# EAGLE design SpheroRemote (EAGLE 9.0.1)
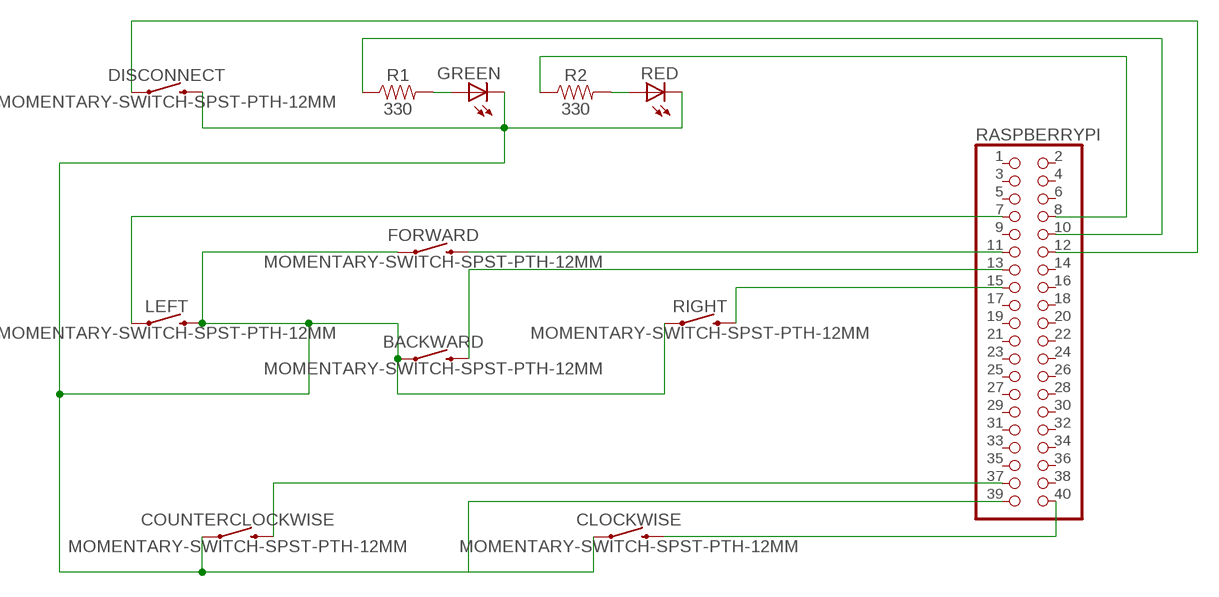
[diagram p0: schematic, sheet 1]

## Parts
BACKWARD  MOMENTARY-SWITCH-SPST-PTH-12MM  [TACTILE_SWITCH_PTH_12MM]
CLOCKWISE  MOMENTARY-SWITCH-SPST-PTH-12MM  [TACTILE_SWITCH_PTH_12MM]
COUNTERCLOCKWISE  MOMENTARY-SWITCH-SPST-PTH-12MM  [TACTILE_SWITCH_PTH_12MM]
DISCONNECT  MOMENTARY-SWITCH-SPST-PTH-12MM  [TACTILE_SWITCH_PTH_12MM]
FORWARD  MOMENTARY-SWITCH-SPST-PTH-12MM  [TACTILE_SWITCH_PTH_12MM]
GREEN  LED5MM  [LED5MM]
LEFT  MOMENTARY-SWITCH-SPST-PTH-12MM  [TACTILE_SWITCH_PTH_12MM]
R1  330  330OHM-HORIZ-1/10W-5%  [AXIAL-0.3]
R2  330  330OHM-HORIZ-1/10W-5%  [AXIAL-0.3]
RASPBERRYPI  PINHD-2X20  [2X20]
RED  LED5MM  [LED5MM]
RIGHT  MOMENTARY-SWITCH-SPST-PTH-12MM  [TACTILE_SWITCH_PTH_12MM]

## Nets
N$1: R2.P$2 RED.A
N$2: CLOCKWISE.3 RASPBERRYPI.40
N$3: COUNTERCLOCKWISE.3 RASPBERRYPI.37
N$4: R2.P$1 RASPBERRYPI.8
N$5: R1.P$1 RASPBERRYPI.10
N$6: GREEN.A R1.P$2
N$7: BACKWARD.1 CLOCKWISE.1 COUNTERCLOCKWISE.1 DISCONNECT.3 FORWARD.1 GREEN.K(C) LEFT.3 RASPBERRYPI.39 RED.K(C) RIGHT.1
N$8: LEFT.1 RASPBERRYPI.7
N$9: FORWARD.3 RASPBERRYPI.11
N$10: BACKWARD.3 RASPBERRYPI.13
N$11: RASPBERRYPI.15 RIGHT.3
N$12: DISCONNECT.1 RASPBERRYPI.12
Unconnected: RASPBERRYPI.1 RASPBERRYPI.2 RASPBERRYPI.3 RASPBERRYPI.4 RASPBERRYPI.5 RASPBERRYPI.6 RASPBERRYPI.9 RASPBERRYPI.14 RASPBERRYPI.16 RASPBERRYPI.17 RASPBERRYPI.18 RASPBERRYPI.19 RASPBERRYPI.20 RASPBERRYPI.21 RASPBERRYPI.22 RASPBERRYPI.23 RASPBERRYPI.24 RASPBERRYPI.25 RASPBERRYPI.26 RASPBERRYPI.27 RASPBERRYPI.28 RASPBERRYPI.29 RASPBERRYPI.30 RASPBERRYPI.31 RASPBERRYPI.32 RASPBERRYPI.33 RASPBERRYPI.34 RASPBERRYPI.35 RASPBERRYPI.36 RASPBERRYPI.38

## Library data of the parts
BACKWARD CLOCKWISE COUNTERCLOCKWISE DISCONNECT FORWARD LEFT RIGHT = SparkFun-Switches:MOMENTARY-SWITCH-SPST: Momentary Switch (Pushbutton) - SPST Normally-open (NO) SPST momentary switches (buttons, pushbuttons). Variants PTH-12MM - 12mm square, through-hole Momentary Pushbutton Switch - 12mm Square <https://www.sparkfun.com/products/9190> (COM-09190) PTH-6.0MM, PTH-6.0MM-KIT - 6.0mm square, through-hole Mini Pushbutton Switch <https://www.sparkfun.com/products/97> (COM-00097) KIT package intended for soldering kit's - only one side of pads' copper is exposed. PTH-RIGHT-ANGLE-KIT - Right-angle, through-hole Right Angle Tactile Button <https://www.sparkfun.com/products/10791> - Used on SparkFun BigTime Watch Kit <https://www.sparkfun.com/products/11734> SMD-12MM - 12mm square, surface-mount Tactile Button - SMD (12mm) <https://www.sparkfun.com/products/12993> (COM-12993) Used on SparkFun PicoBoard <https://www.sparkfun.com/products/11888> SMD-4.5MM - 4.5mm Square Trackball Switch Used on SparkFun Blackberry Trackballer Breakout <https://www.sparkfun.com/products/13169> SMD-4.6MMX2.8MM - 4.60mm x 2.80mm, surface mount Used on SparkFun SAMD21 Mini Breakout <https://www.sparkfun.com/products/13664> SMD-5.2MM, SMD-5.2-REDUNDANT - 5.2mm square, surface-mount Mini Pushbutton Switch - SMD <https://www.sparkfun.com/products/8720> (COM-08720) Used on Arduino Pro Mini <https://www.sparkfun.com/products/11114> REDUNDANT package connects both switch circuits together SMD-6.0X3.5MM - 6.0 x 3.5mm, surface mount Momentary Reset Switch SMD <https://www.sparkfun.com/products/8229> (COM-08229) SMD-6.2MM-TALL - 6.2mm square, surface mount Tactile Button - SMD (6mm) <https://www.sparkfun.com/products/12992> Used on SparkFun Digital Sandbox <https://www.sparkfun.com/products/12651> SMD-RIGHT-ANGLE - Right-angle, surface mount Used on SparkFun Block for Intel® Edison - Arduino <https://www.sparkfun.com/products/13036>; PROD_ID: SWCH-09185; SF_SKU: COM-09190
GREEN RED = adafruit:LED: LED OSRAM: - CHIPLED LG R971, LG N971, LY N971, LG Q971, LY Q971, LO R971, LY R971 LH N974, LH R974 LS Q976, LO Q976, LY Q976 LO Q996 - Hyper CHIPLED LW Q18S LB Q993, LB Q99A, LB R99A - SideLED LS A670, LO A670, LY A670, LG A670, LP A670 LB A673, LV A673, LT A673, LW A673 LH A674 LY A675 LS A676, LA A676, LO A676, LY A676, LW A676 LS A679, LY A679, LG A679 - Hyper Micro SIDELED® LS Y876, LA Y876, LO Y876, LY Y876 LT Y87S - SmartLED LW L88C, LW L88S LB L89C, LB L89S, LG L890 LS L89K, LO L89K, LY L89K LS L896, LA L896, LO L896, LY L896 - TOPLED LS T670, LO T670, LY T670, LG T670, LP T670 LSG T670, LSP T670, LSY T670, LOP T670, LYG T670 LG T671, LOG T671, LSG T671 LB T673, LV T673, LT T673, LW T673 LH T674 LS T676, LA T676, LO T676, LY T676, LB T676, LH T676, LSB T676, LW T676 LB T67C, LV T67C, LT T67C, LS T67K, LO T67K, LY T67K, LW E67C LS E67B, LA E67B, LO E67B, LY E67B, LB E67C, LV E67C, LT E67C LW T67C LS T679, LY T679, LG T679 LS T770, LO T770, LY T770, LG T770, LP T770 LB T773, LV T773, LT T773, LW T773 LH T774 LS E675, LA E675, LY E675, LS T675 LS T776, LA T776, LO T776, LY T776, LB T776 LHGB T686 LT T68C, LB T68C - Hyper Mini TOPLED® LB M676 - Mini TOPLED Santana® LG M470 LS M47K, LO M47K, LY M47K Source: http://www.osram.convergy.de/
R1 R2 = SparkFun-Resistors:330OHM: 330Ω resistor A resistor is a passive two-terminal electrical component that implements electrical resistance as a circuit element. Resistors act to reduce current flow, and, at the same time, act to lower voltage levels within circuits. - Wikipedia; PROD_ID: RES-8371
RASPBERRYPI = adafruit:PINHD-2X20: PIN HEADER

## Board
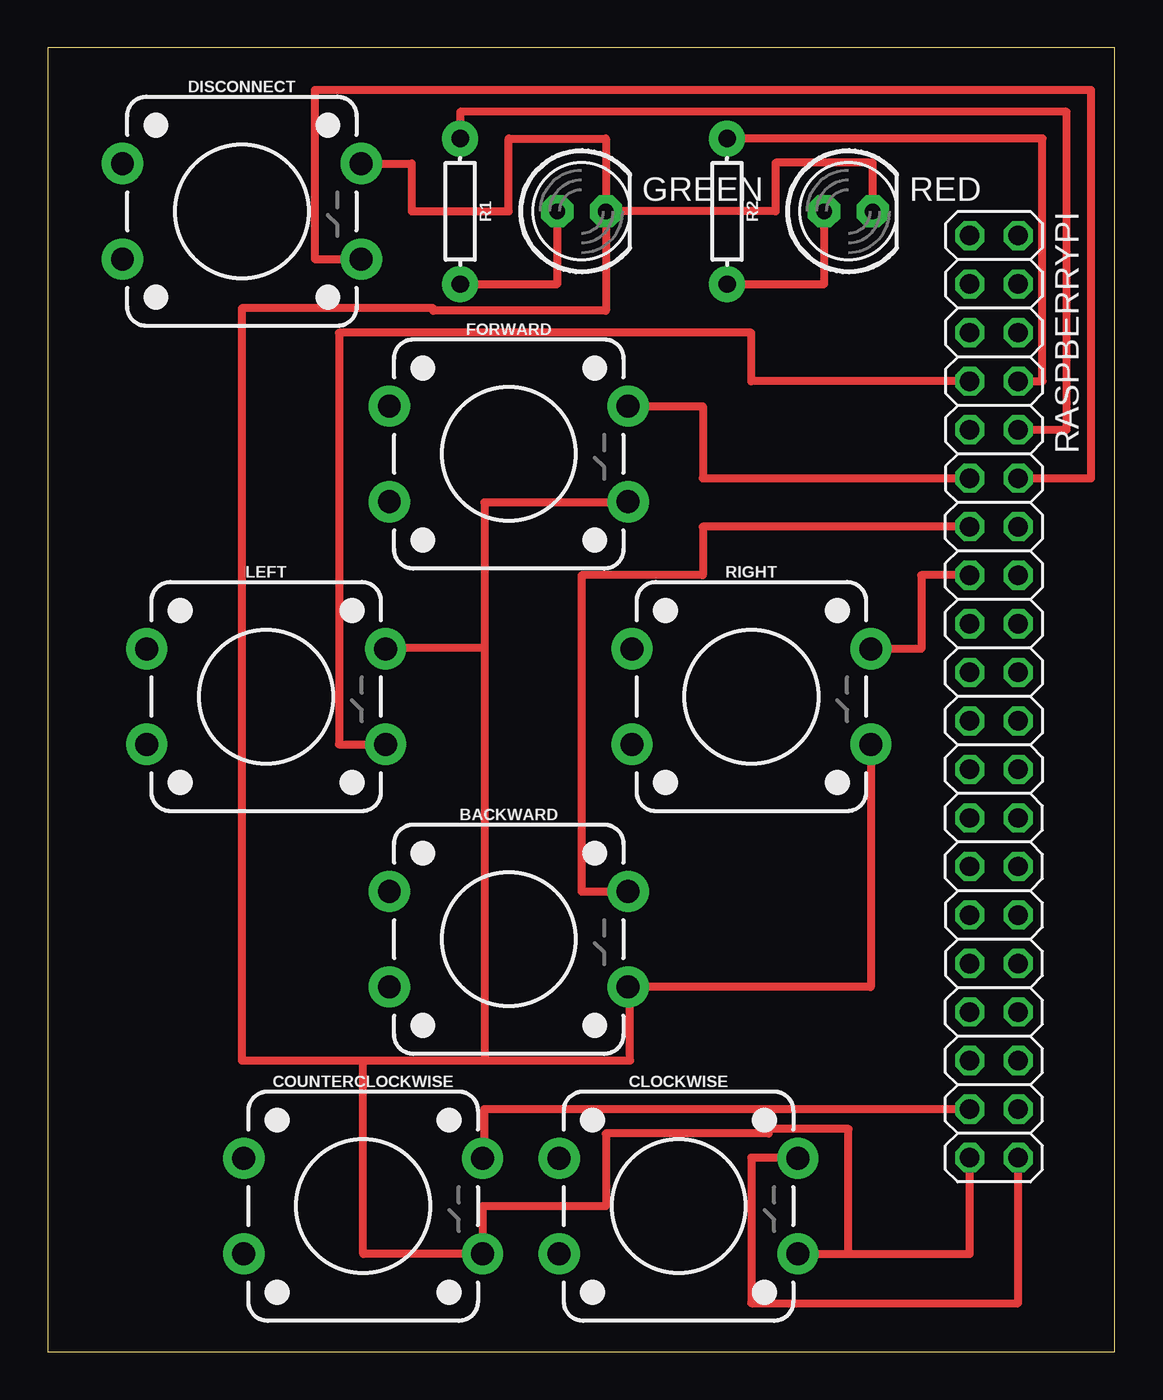
[diagram p1: board, top side]

Size 55.86 x 68.25 mm. Coordinates in mm from the lower left corner, seen from the top.
Outline: 0,0 55.86,0 55.86,68.25 0,68.25 0,0
Copper layers (1*16): Top 0.035mm / dielectric 1.5mm / Bottom 0.035mm
Design rules "default *": minimum track width 16mil, minimum drill 0.35mm, track to track 6mil, track to pad 6mil, pad to pad 6mil, via to via 6mil, smd to smd 6mil, copper to edge 40mil, drill to drill 6mil, minimum pad ring 10mil, minimum via ring 8mil, stop-mask expansion 4mil, vias tented up to drill 0mil, thermal gap 10mil

### Footprints (pad centres in the part's own frame; a part is rotated, then mirrored left to right if it is on the bottom)
TACTILE_SWITCH_PTH_12MM = drill 1.2 pad 2.159: 1 6.25,-2.5; 2 -6.25,-2.5; 3 6.25,2.5; 4 -6.25,2.5
LED5MM = drill 0.813 pad 1.676 octagon: A -1.27,0; K 1.27,0
AXIAL-0.3 = drill 0.9 pad 1.88: P$1 -3.81,0; P$2 3.81,0
2X20 = drill 1.016 octagon: 1 -24.13,-1.27; 2 -24.13,1.27; 3 -21.59,-1.27; 4 -21.59,1.27; 5 -19.05,-1.27; 6 -19.05,1.27; 7 -16.51,-1.27; 8 -16.51,1.27; 9 -13.97,-1.27; 10 -13.97,1.27; 11 -11.43,-1.27; 12 -11.43,1.27; 13 -8.89,-1.27; 14 -8.89,1.27; 15 -6.35,-1.27; 16 -6.35,1.27; 17 -3.81,-1.27; 18 -3.81,1.27; 19 -1.27,-1.27; 20 -1.27,1.27; 21 1.27,-1.27; 22 1.27,1.27; 23 3.81,-1.27; 24 3.81,1.27; 25 6.35,-1.27; 26 6.35,1.27; 27 8.89,-1.27; 28 8.89,1.27; 29 11.43,-1.27; 30 11.43,1.27; 31 13.97,-1.27; 32 13.97,1.27; 33 16.51,-1.27; 34 16.51,1.27; 35 19.05,-1.27; 36 19.05,1.27; 37 21.59,-1.27; 38 21.59,1.27; 39 24.13,-1.27; 40 24.13,1.27

### Placement (x,y rotation side)
BACKWARD  24.13,21.59 0 top
CLOCKWISE  33.02,7.62 0 top
COUNTERCLOCKWISE  16.51,7.62 0 top
DISCONNECT  10.16,59.69 0 top
FORWARD  24.13,46.99 0 top
GREEN  27.94,59.69 0 top
LEFT  11.43,34.29 0 top
R1  21.59,59.69 270 top
R2  35.56,59.69 270 top
RASPBERRYPI  49.53,34.29 270 top
RED  41.91,59.69 0 top
RIGHT  36.83,34.29 0 top

### Tracks (layer width: path | path; a pad name or v marks a point on that pad's centre or on a via)
N$1
  Top 0.406: R2.P$2 40.64,55.88 RED.A
N$2
  Top 0.406: CLOCKWISE.3 39.23,10.16 36.83,10.16 36.83,2.54 50.8,2.54 RASPBERRYPI.40
N$3
  Top 0.406: COUNTERCLOCKWISE.3 22.86,10.22 22.86,12.7 RASPBERRYPI.37
N$4
  Top 0.406: RASPBERRYPI.8 52.07,50.8 52.07,63.5 R2.P$1
N$5
  Top 0.406: RASPBERRYPI.10 53.34,48.26 53.34,64.9 21.59,64.9 R1.P$1
N$6
  Top 0.406: R1.P$2 26.67,55.88 GREEN.A
N$7
  Top 0.406: DISCONNECT.3 19.05,62.19 19.05,59.69 24.13,59.69 24.13,63.5 29.21,63.5 GREEN.K | RED.K 43.18,62.23 38.1,62.23 38.1,59.69 GREEN.K | FORWARD.1 30.38,44.45 22.86,44.45 22.86,36.83 | 22.86,36.83 17.78,36.83 17.78,36.79 LEFT.3 | RIGHT.1 43.08,19.09 BACKWARD.1 30.48,19.09 30.48,15.24 22.86,15.24 | CLOCKWISE.1 41.91,5.12 | 41.91,5.12 48.26,5.12 RASPBERRYPI.39 | 41.91,5.12 41.91,11.66 37.73,11.66 37.73,11.43 29.21,11.43 29.21,7.62 22.76,7.62 COUNTERCLOCKWISE.1 16.51,5.12 16.51,15.24 | 16.51,15.24 22.86,15.24 | 22.86,36.83 22.86,15.24 | GREEN.K 29.21,54.48 20.19,54.48 20.19,54.61 10.16,54.61 10.16,15.24 16.51,15.24
N$8
  Top 0.406: RASPBERRYPI.7 36.83,50.8 36.83,53.34 15.24,53.34 15.24,31.79 LEFT.1
N$9
  Top 0.406: FORWARD.3 34.29,49.49 34.29,45.72 RASPBERRYPI.11
N$10
  Top 0.406: BACKWARD.3 27.94,24.09 27.94,40.64 34.29,40.64 34.29,43.18 RASPBERRYPI.13
N$11
  Top 0.406: RASPBERRYPI.15 45.72,40.64 45.72,36.79 RIGHT.3
N$12
  Top 0.406: RASPBERRYPI.12 54.61,45.72 54.61,66.04 13.97,66.04 13.97,57.19 DISCONNECT.1